# EAGLE board 6502-thing (EAGLE 9.6.0), part 1 of 2
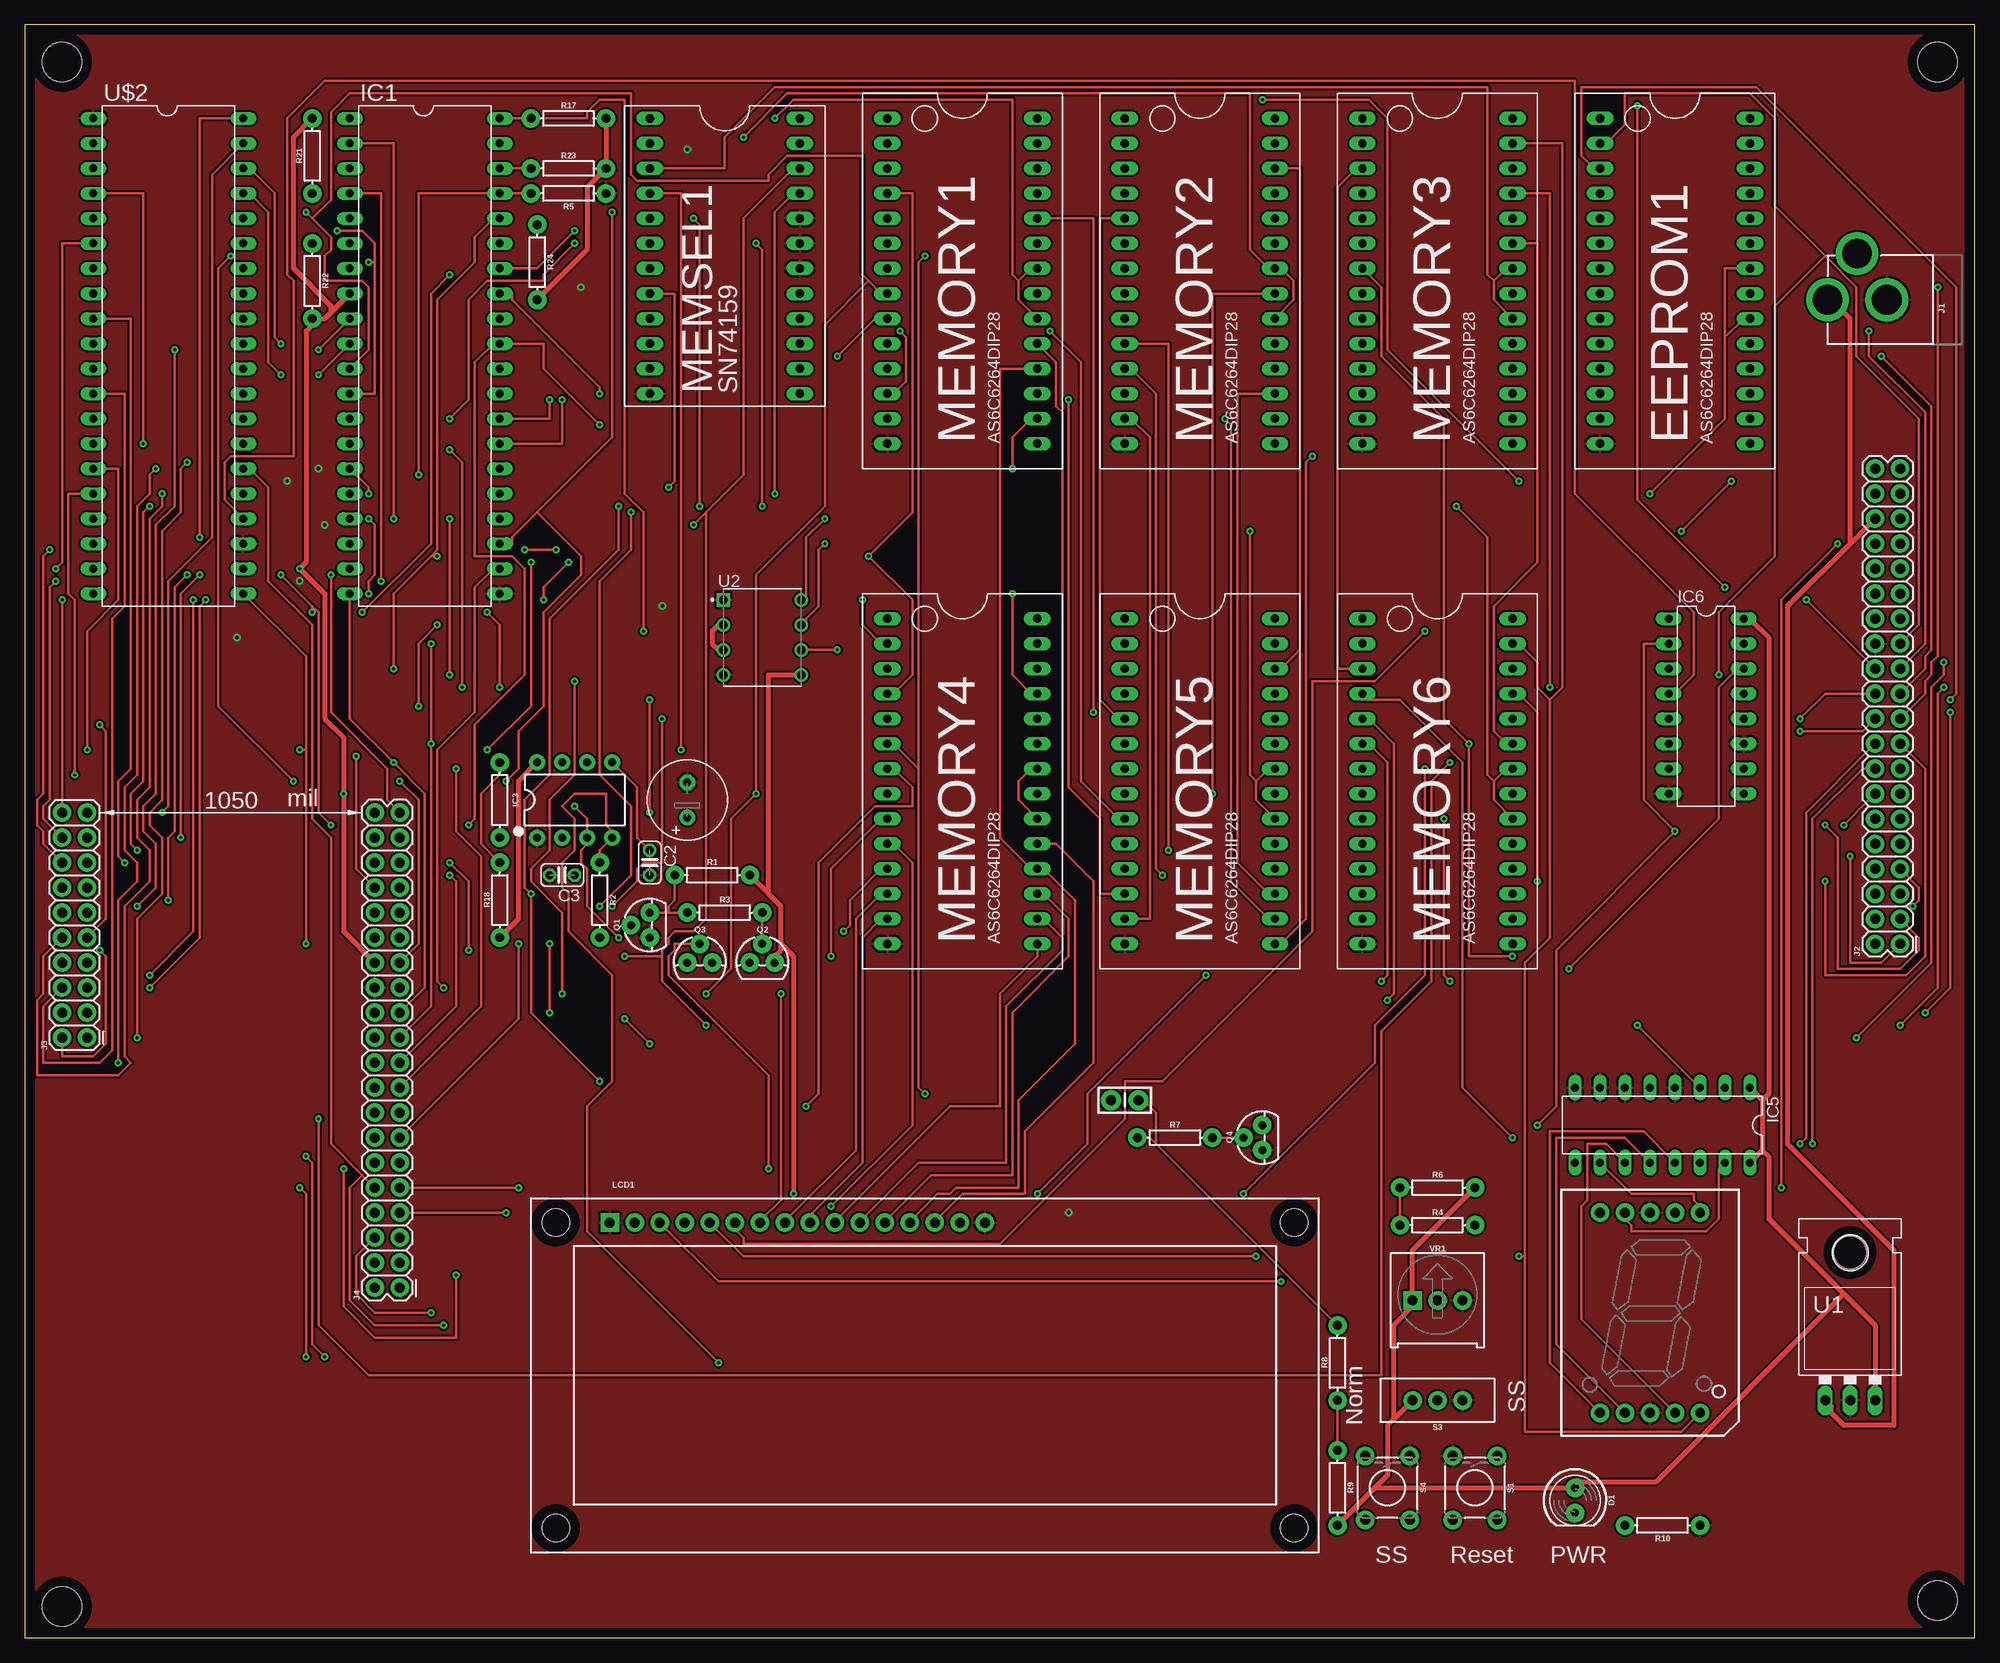
[diagram p1: board, top side]
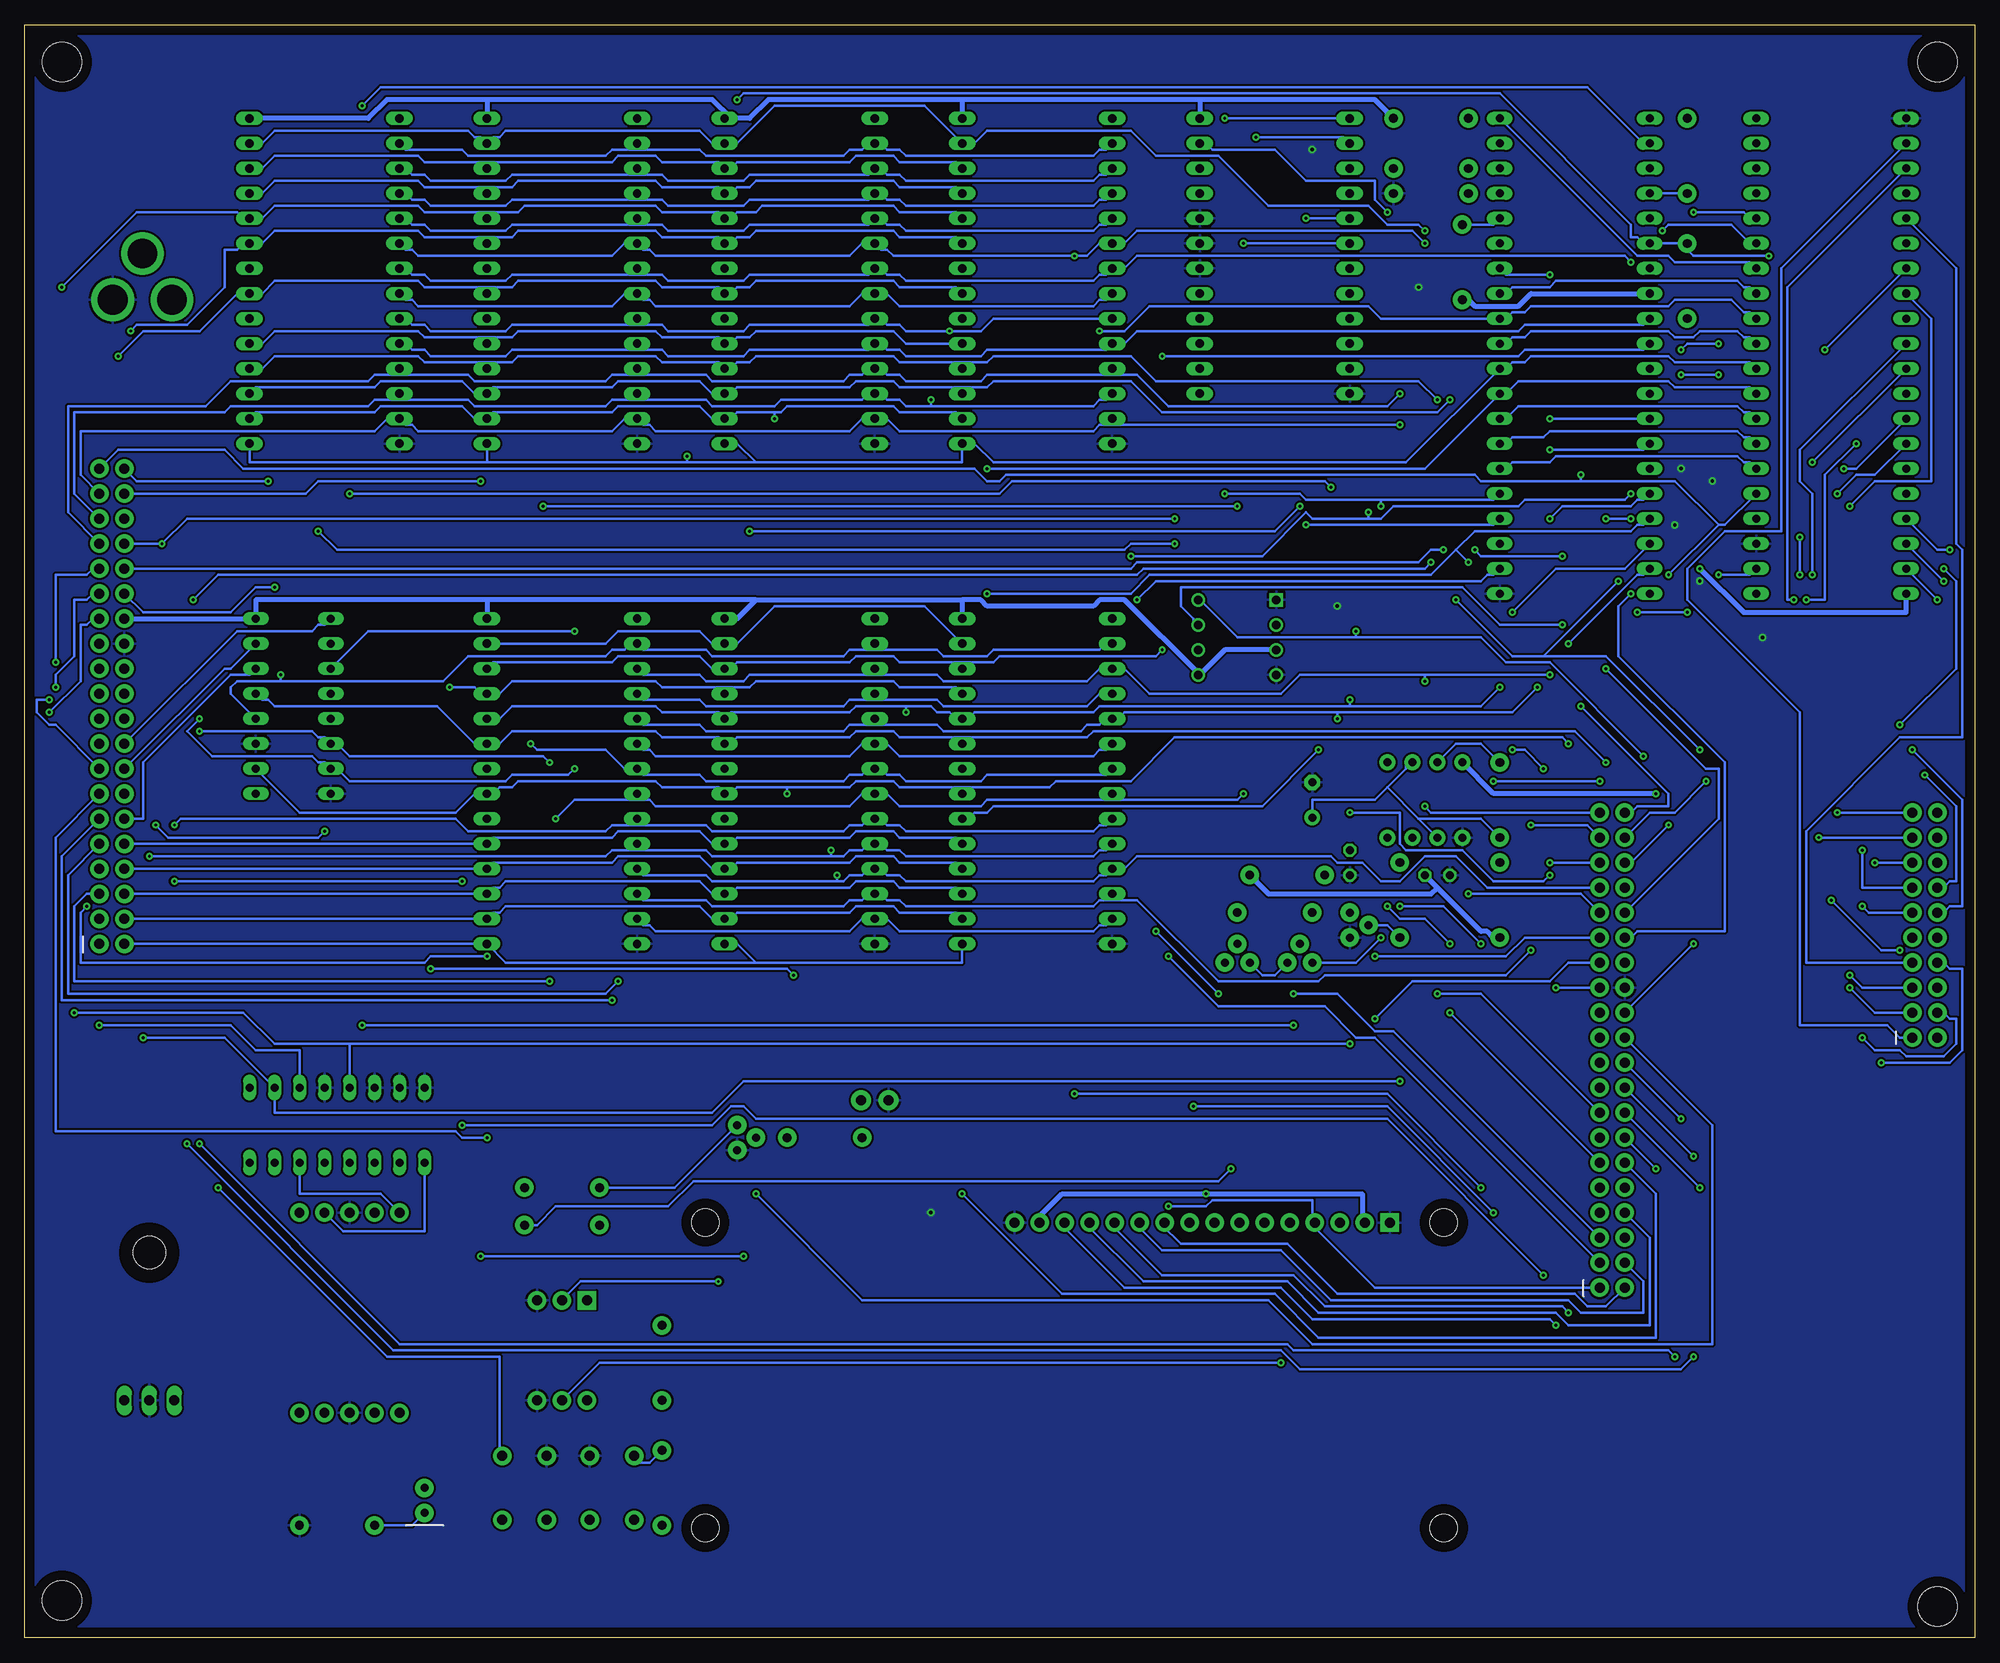
[diagram p2: board, bottom side, seen from below]

Size 198.1 x 163.83 mm. Coordinates in mm from the lower left corner, seen from the top.
Outline: 0,0 198.1,0 198.1,163.83 0,163.83 0,0
Copper layers (1*16): Top 0.035mm / dielectric 1.5mm / Bottom 0.035mm
Design rules "PCBway *": minimum track width 6mil, minimum drill 0.3mm, track to track 0.205mm, track to pad 0.205mm, pad to pad 0.205mm, via to via 0.205mm, smd to smd 8mil, copper to edge 40mil, drill to drill 8mil, minimum pad ring 10mil, minimum via ring 8mil, stop-mask expansion 4mil, vias tented up to drill 25mil, thermal gap 10mil
Net classes: 0 default: width 0.254 mm, clearance 0.127 mm; 1 power: width 0.508 mm, clearance 0.254 mm to class 0, clearance 0.127 mm
Holes 4 mm at 3.81,160.02 194.31,160.02 194.31,3.81 3.81,3.18

## Footprints (pad centres in the part's own frame; a part is rotated, then mirrored left to right if it is on the bottom)
E3,5-8 = drill 0.813 pad 1.6: + -1.778,0 | drill 0.813 pad 1.6 octagon: - 1.778,0
C025-024X044 = drill 0.813 octagon: 1 -1.27,0; 2 1.27,0
CAP-PTH-SMALL-KIT = drill 1.016 pad 2.032: 1 -1.397,0; 2 1.397,0
LED_5MM = drill 0.813 pad 1.88: A -1.27,0; K 1.27,0
0.6"_DIP28 = drill 0.85 long: 1 0,0; 2 0,-2.54; 3 0,-5.08; 4 0,-7.62; 5 0,-10.16; 6 0,-12.7; 7 0,-15.24; 8 0,-17.78; 9 0,-20.32; 10 0,-22.86; 11 0,-25.4; 12 0,-27.94; 13 0,-30.48; 14 0,-33.02; 15 15.24,-33.02; 16 15.24,-30.48; 17 15.24,-27.94; 18 15.24,-25.4; 19 15.24,-22.86; 20 15.24,-20.32; 21 15.24,-17.78; 22 15.24,-15.24; 23 15.24,-12.7; 24 15.24,-10.16; 25 15.24,-7.62; 26 15.24,-5.08; 27 15.24,-2.54; 28 15.24,0
DIL40 = drill 0.813 long: 1 -24.13,-7.62; 2 -21.59,-7.62; 3 -19.05,-7.62; 4 -16.51,-7.62; 5 -13.97,-7.62; 6 -11.43,-7.62; 7 -8.89,-7.62; 8 -6.35,-7.62; 9 -3.81,-7.62; 10 -1.27,-7.62; 11 1.27,-7.62; 12 3.81,-7.62; 13 6.35,-7.62; 14 8.89,-7.62; 15 11.43,-7.62; 16 13.97,-7.62; 17 16.51,-7.62; 18 19.05,-7.62; 19 21.59,-7.62; 20 24.13,-7.62; 21 24.13,7.62; 22 21.59,7.62; 23 19.05,7.62; 24 16.51,7.62; 25 13.97,7.62; 26 11.43,7.62; 27 8.89,7.62; 28 6.35,7.62; 29 3.81,7.62; 30 1.27,7.62; 31 -1.27,7.62; 32 -3.81,7.62; 33 -6.35,7.62; 34 -8.89,7.62; 35 -11.43,7.62; 36 -13.97,7.62; 37 -16.51,7.62; 38 -19.05,7.62; 39 -21.59,7.62; 40 -24.13,7.62
DIP08 = drill 0.813 pad 1.626: 1 -3.81,-3.81; 2 -1.27,-3.81; 3 1.27,-3.81; 4 3.81,-3.81; 5 3.81,3.81; 6 1.27,3.81; 7 -1.27,3.81; 8 -3.81,3.81
DIL16 = drill 0.813 long: 1 -8.89,-3.81; 2 -6.35,-3.81; 3 -3.81,-3.81; 4 -1.27,-3.81; 5 1.27,-3.81; 6 3.81,-3.81; 7 6.35,-3.81; 8 8.89,-3.81; 9 8.89,3.81; 10 6.35,3.81; 11 3.81,3.81; 12 1.27,3.81; 13 -1.27,3.81; 14 -3.81,3.81; 15 -6.35,3.81; 16 -8.89,3.81
POWER_JACK_PTH = drill 2.997 pad 4.318: GND 0,7.7; GNDBREAK 4.7,10.7; PWR 0,13.7
2X20 = drill 1.016 pad 1.88: 1 0,0; 2 0,2.54; 3 2.54,0; 4 2.54,2.54; 5 5.08,0; 6 5.08,2.54; 7 7.62,0; 8 7.62,2.54; 9 10.16,0; 10 10.16,2.54; 11 12.7,0; 12 12.7,2.54; 13 15.24,0; 14 15.24,2.54; 15 17.78,0; 16 17.78,2.54; 17 20.32,0; 18 20.32,2.54; 19 22.86,0; 20 22.86,2.54; 21 25.4,0; 22 25.4,2.54; 23 27.94,0; 24 27.94,2.54; 25 30.48,0; 26 30.48,2.54; 27 33.02,0; 28 33.02,2.54; 29 35.56,0; 30 35.56,2.54; 31 38.1,0; 32 38.1,2.54; 33 40.64,0; 34 40.64,2.54; 35 43.18,0; 36 43.18,2.54; 37 45.72,0; 38 45.72,2.54; 39 48.26,0; 40 48.26,2.54
2X10 = drill 1.016 pad 1.88: 1 0,0; 2 0,2.54; 3 2.54,0; 4 2.54,2.54; 5 5.08,0; 6 5.08,2.54; 7 7.62,0; 8 7.62,2.54; 9 10.16,0; 10 10.16,2.54; 11 12.7,0; 12 12.7,2.54; 13 15.24,0; 14 15.24,2.54; 15 17.78,0; 16 17.78,2.54; 17 20.32,0; 18 20.32,2.54; 19 22.86,0; 20 22.86,2.54
LCD-16X2 = drill 1.016 pad 1.88 square: 1 -32,15.5 | drill 1.016 pad 1.88: 2 -29.46,15.5; 3 -26.92,15.5; 4 -24.38,15.5; 5 -21.84,15.5; 6 -19.3,15.5; 7 -16.76,15.5; 8 -14.22,15.5; 9 -11.68,15.5; 10 -9.14,15.5; 11 -6.6,15.5; 12 -4.06,15.5; 13 -1.52,15.5; 14 1.02,15.5; 15 3.56,15.5; 16 6.1,15.5 | hole 2.8: -37.5,15.5; -37.5,-15.5; 37.5,15.5; 37.5,-15.5
0.6"_DIP24 = drill 0.85 long: P$1 0,0; P$2 0,-2.54; P$3 0,-5.08; P$4 0,-7.62; P$5 0,-10.16; P$6 0,-12.7; P$7 0,-15.24; P$8 0,-17.78; P$9 0,-20.32; P$10 0,-22.86; P$11 0,-25.4; P$12 0,-27.94; P$13 15.24,-27.94; P$14 15.24,-25.4; P$15 15.24,-22.86; P$16 15.24,-20.32; P$17 15.24,-17.78; P$18 15.24,-15.24; P$19 15.24,-12.7; P$20 15.24,-10.16; P$21 15.24,-7.62; P$22 15.24,-5.08; P$23 15.24,-2.54; P$24 15.24,0
TO-92 = drill 0.813 pad 1.88: 1 -1.27,0; 2 0,1.905; 3 1.27,0
AXIAL-0.3 = drill 0.9 pad 1.88: P$1 -3.81,0; P$2 3.81,0
TACTILE_SWITCH_PTH_6.0MM = drill 1.016 pad 1.88: 1 -3.251,2.261; 2 3.251,2.261; 3 -3.251,-2.261; 4 3.251,-2.261
SWITCH_SPDT_PTH_11.6X4.0MM = drill 1.016 pad 1.88: 1 0,2.54; 2 0,0; 3 0,-2.54
TO-220-ALT = drill 1.016 long: GND 0,-3.81; IN -2.54,-3.81; OUT 2.54,-3.81 | hole 3.302: 0,11.176
DIP794W47P254L991H457Q8 = drill 0.86 pad 1.21 square: 1 -3.97,3.81 | drill 0.86 pad 1.21: 2 -3.97,1.27; 3 -3.97,-1.27; 4 -3.97,-3.81; 5 3.97,-3.81; 6 3.97,-1.27; 7 3.97,1.27; 8 3.97,3.81
7-SEGMENT-1"PTH = drill 1 pad 1.88: 1 -5.08,-10.16; 2 -2.54,-10.16; 3 0,-10.16; 4 2.54,-10.16; 5 5.08,-10.16; 6 5.08,10.16; 7 2.54,10.16; 8 0,10.16; 9 -2.54,10.16; 10 -5.08,10.16
TRIMPOT-PTH-3386U = drill 1.016 pad 1.88 square: 1 -2.54,-0.015 | drill 1.016 pad 1.88: 2 0,-0.015; 3 2.54,-0.015

## Placement (x,y rotation side)
C1  1uF  [E3,5-8]  67.31,85.09 90 top
C2  .01uF  [C025-024X044]  63.5,78.74 270 top
C3  .1uF  [C025-024X044]  54.61,77.47 180 top
C4  0.1uF  [CAP-PTH-SMALL-KIT]  111.76,54.61 180 top
D1  Power  [LED_5MM]  157.48,13.97 270 top
EEPROM1  AS6C6264DIP28  [0.6"_DIP28]  160.02,154.31 0 top
IC1  6502  [DIL40]  40.64,130.18 270 top
IC3  555  [DIP08]  55.88,85.09 0 top
IC5  4056N  [DIL16]  166.37,52.07 180 top
IC6  4028N  [DIL16]  170.81,94.62 270 top
J1  POWER_JACK  [POWER_JACK_PTH]  196.85,135.89 90 top
J2  CONN_20X2  [2X20]  190.5,70.48 90 top
J3  IO  [2X10]  6.35,60.96 90 top
J4  CONN_20X2  [2X20]  38.1,35.56 90 top
LCD1  LCD-16X2SILK  [LCD-16X2]  91.44,26.67 0 top
MEMORY1  AS6C6264DIP28  [0.6"_DIP28]  87.63,154.31 0 top
MEMORY2  AS6C6264DIP28  [0.6"_DIP28]  111.76,154.31 0 top
MEMORY3  AS6C6264DIP28  [0.6"_DIP28]  135.89,154.31 0 top
MEMORY4  AS6C6264DIP28  [0.6"_DIP28]  87.63,103.5 0 top
MEMORY5  AS6C6264DIP28  [0.6"_DIP28]  111.76,103.5 0 top
MEMORY6  AS6C6264DIP28  [0.6"_DIP28]  135.89,103.5 0 top
MEMSEL1  SN74159  [0.6"_DIP24]  63.5,154.31 0 top
Q1  200mA/40V  [TO-92]  63.5,72.39 90 top
Q2  200mA/40V  [TO-92]  74.93,68.58 0 top
Q3  200mA/40V  [TO-92]  68.58,68.58 0 top
Q4  200mA/40V  [TO-92]  125.73,50.8 90 top
R1  1k  [AXIAL-0.3]  69.85,77.47 0 top
R2  10k  [AXIAL-0.3]  58.42,74.93 270 top
R3  10k  [AXIAL-0.3]  71.12,73.66 0 top
R4  10k  [AXIAL-0.3]  143.51,41.91 0 top
R5  1k  [AXIAL-0.3]  55.25,146.69 180 top
R6  1k  [AXIAL-0.3]  143.51,45.72 0 top
R7  10k  [AXIAL-0.3]  116.84,50.8 0 top
R8  10k  [AXIAL-0.3]  133.35,27.94 90 top
R9  10k  [AXIAL-0.3]  133.35,15.24 270 top
R10  330  [AXIAL-0.3]  166.37,11.43 180 top
R17  10k  [AXIAL-0.3]  55.25,154.31 0 top
R18  1k  [AXIAL-0.3]  48.26,74.93 90 top
R19  1k  [AXIAL-0.3]  48.26,85.09 270 top
R21  1k  [AXIAL-0.3]  29.21,150.5 90 top
R22  1k  [AXIAL-0.3]  29.21,137.8 270 top
R23  1k  [AXIAL-0.3]  55.25,149.22 0 top
R24  1k  [AXIAL-0.3]  52.07,139.7 270 top
S1  MOMENTARY-SWITCH-SPST-PTH-6.0MM  [TACTILE_SWITCH_PTH_6.0MM]  147.32,15.24 270 top
S3  Clock Stopper  [SWITCH_SPDT_PTH_11.6X4.0MM]  143.51,24.13 90 top
S4  MOMENTARY-SWITCH-SPST-PTH-6.0MM  [TACTILE_SWITCH_PTH_6.0MM]  138.43,15.24 270 top
U1  5V  [TO-220-ALT]  185.42,27.94 0 top
U2  DS1830+  [DIP794W47P254L991H457Q8]  74.93,101.6 0 top
U$1  YSD-160AB3C-8  [7-SEGMENT-1"PTH]  165.1,33.02 0 top
U$2  W65C22S6TP  [DIL40]  14.61,130.18 270 top
VR1  10k  [TRIMPOT-PTH-3386U]  143.51,34.29 0 top